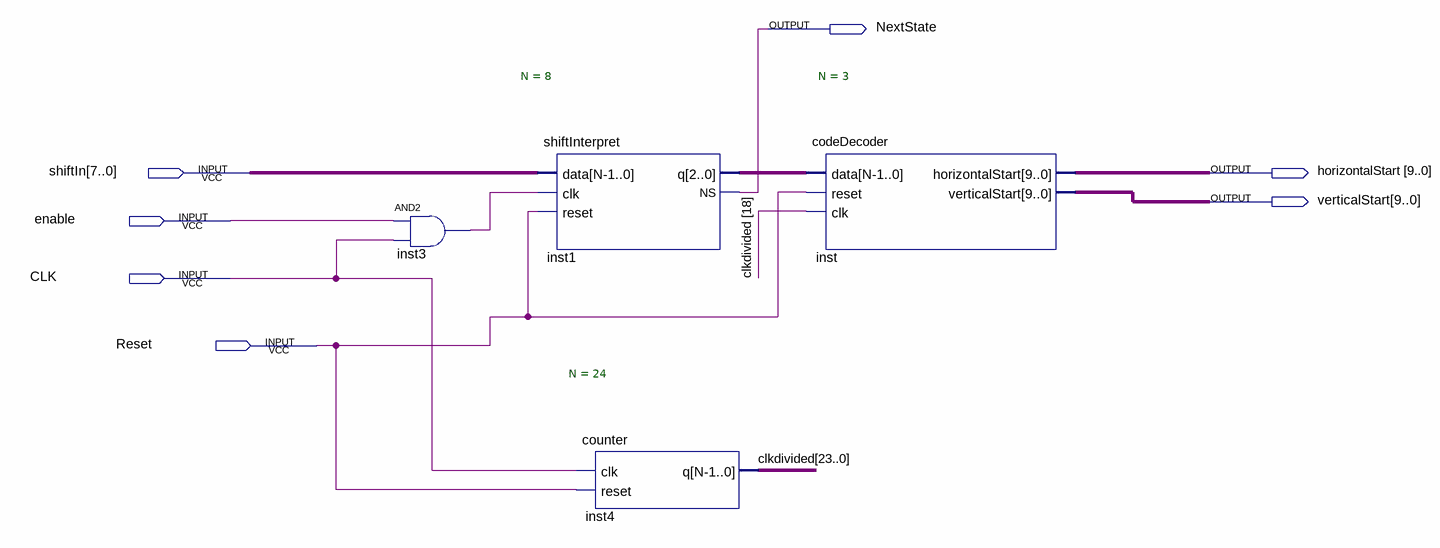
[diagram p0: schematic sheet]
// Quartus schematic IR_Decode.bdf as structural Verilog: 4 symbols, 7 pins
module IR_Decode (
  input  [7:0] shiftIn,
  input  enable,
  input  CLK,
  input  Reset,
  output NextState,
  output [9:0] horizontalStart,
  output [9:0] verticalStart
);

  wire inst3_out;
  wire [2:0] inst1_q;
  wire [23:0] clkdivided;

  and inst3 (inst3_out, enable, CLK);
  shiftInterpret #(.N(8)) inst1 (.data(shiftIn), .clk(inst3_out), .reset(Reset), .q(inst1_q), .NS(NextState));
  counter #(.N(24)) inst4 (.clk(CLK), .reset(Reset), .q(clkdivided));
  codeDecoder #(.N(3)) inst (
    .data(inst1_q), .reset(Reset), .clk(clkdivided[18]), .horizontalStart(horizontalStart),
    .verticalStart(verticalStart));
endmodule
